# EAGLE design AmbaSat-05-ZMOD4410 (EAGLE 9.3.2)
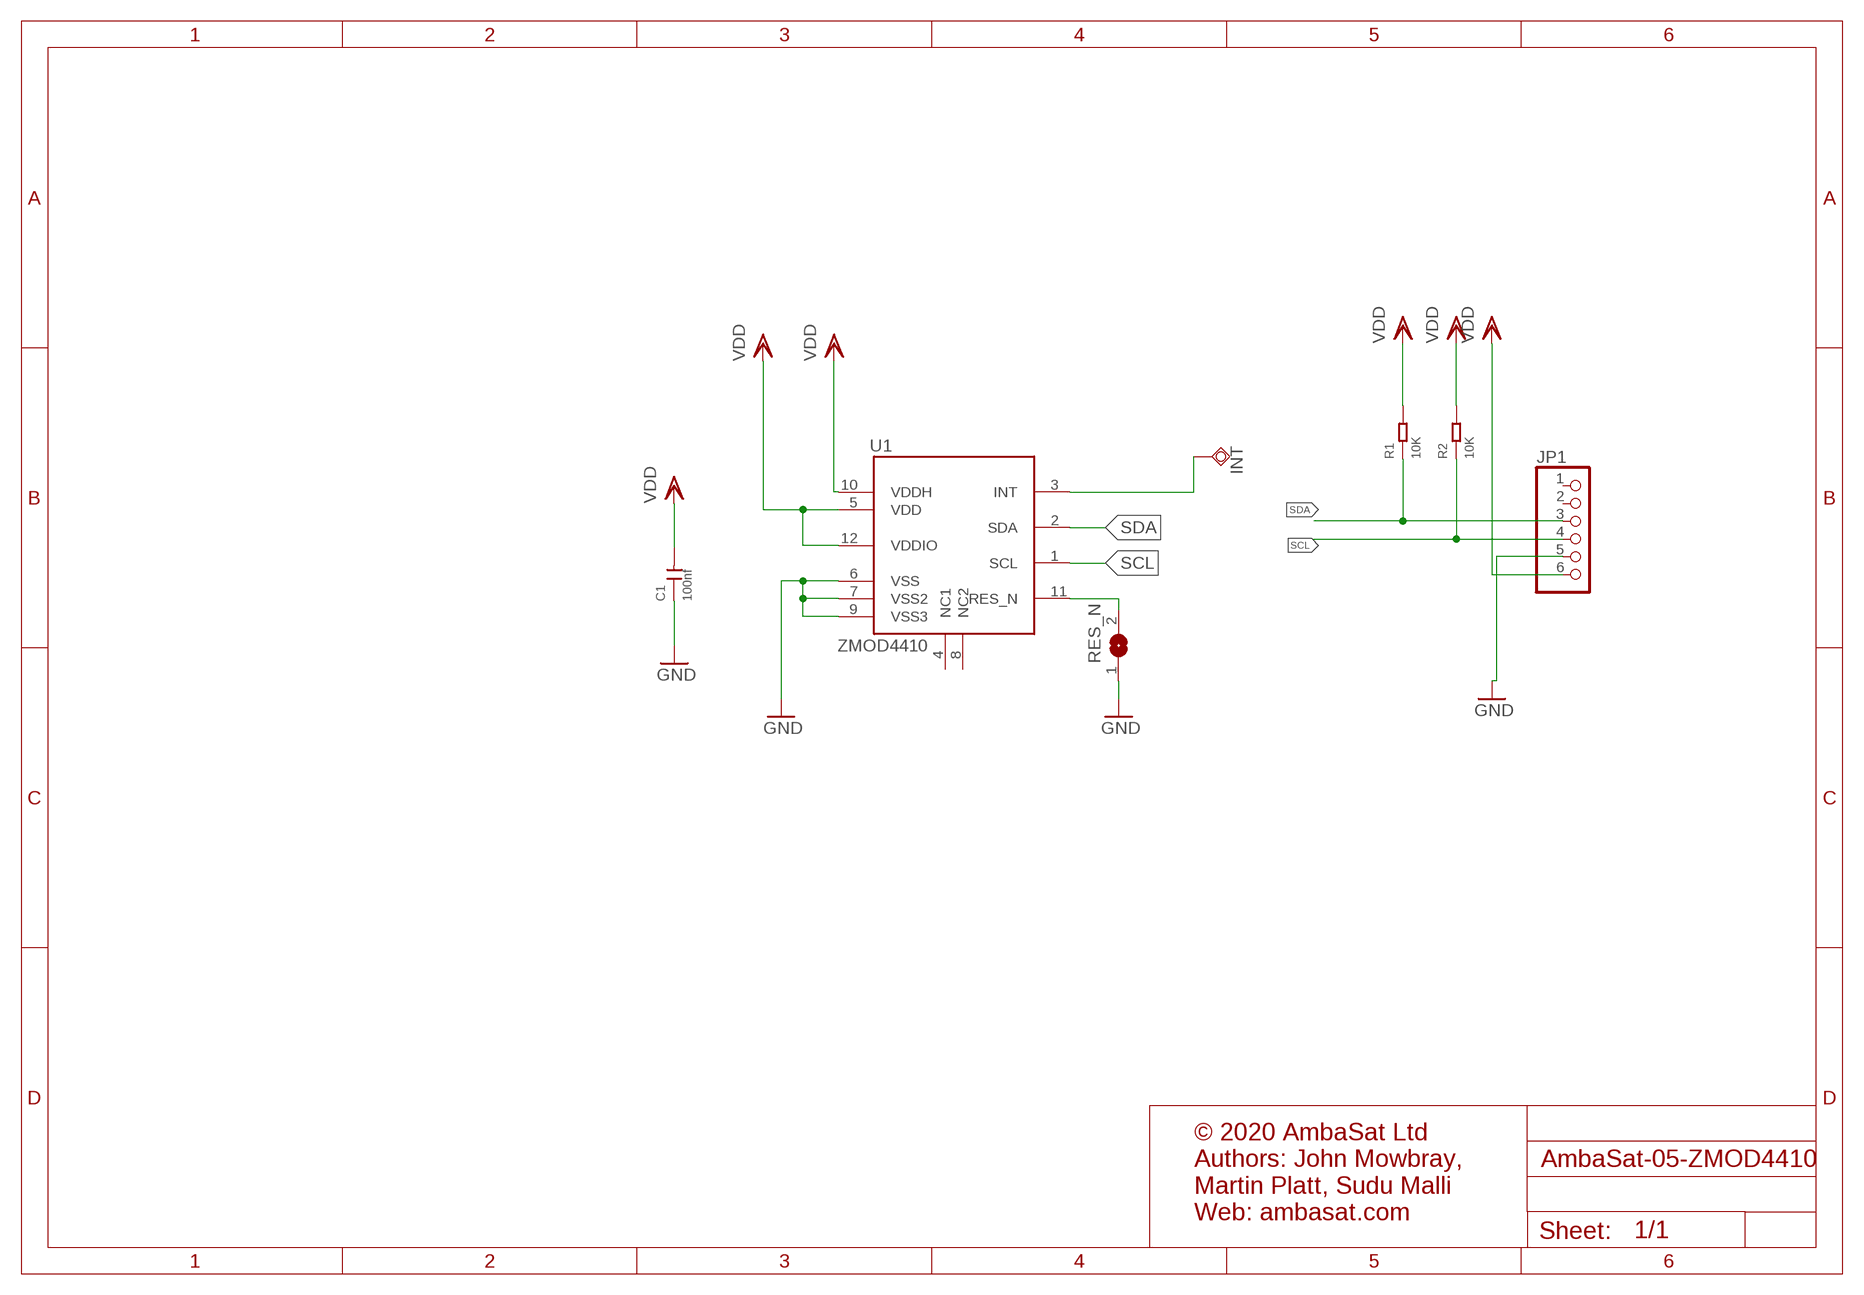
[diagram p0: schematic, sheet 1]

## Parts
C1  100nf  CERAMIC-100NF-50V-10%-X7R(0805)  [C0805]
INT  TESTPAD_TPSQTP12R  [TESTPAD_TP12R]
JP1  HEADER-1X6  [1X06_OVAL]
R1  10K  SMD-RES-10K-1%-1/8W(0805)  [R0805]
R2  10K  SMD-RES-10K-1%-1/8W(0805)  [R0805]
RES_N  SJ  [SJ]
U1  ZMOD4410  [LGG12D1_3X3X0.7_0.5X1]

## Nets
GND: C1.1 JP1.5 RES_N.1 U1.6(VSS) U1.7(VSS2) U1.9(VSS3)
N$1: INT.TP U1.3(INT)
N$2: RES_N.2 U1.11(RES_N)
SCL: JP1.4 R2.1 U1.1(SCL)
SDA: JP1.3 R1.1 U1.2(SDA)
VDD: C1.2 JP1.6 R1.2 R2.2 U1.5(VDD) U1.10(VDDH) U1.12(VDDIO)
Unconnected: JP1.1 JP1.2 U1.4(NC1) U1.8(NC2)

## Notes on the sheet
- © 2020 AmbaSat Ltd
  Authors: John Mowbray, 
  Martin Platt, Sudu Malli
  Web: ambasat.com

## Library data of the parts
C1 = Seeed-Capacitor:CERAMIC-100NF-50V-10%-X7R(0805): 302010165; MPN: CC0805KRX7R9BB104
INT = BeagleBone_Blue_R3:TESTPAD_TPSQ: Test pad
JP1 = microbuilder:HEADER-1X6: PIN HEADER
R1 R2 = Seeed-Resistor:SMD-RES-10K-1%-1/8W(0805): 301010361; MPN: RC0805FR-0710KL
RES_N = jumper:SJ: SMD solder JUMPER
U1 = ZMOD4410AI1V:ZMOD4410: Description The ZMOD4410 Gas Sensor Module is designed for detecting total volatile organic compounds (TVOC) and monitoring indoor air quality (IAQ) in different use cases. It is a 12-pin LGA assembly (3.0  3.0  0.7 mm) that consists of a gas sense element and a CMOS signal conditioning IC. The module’s sense element consists of heater element on a Si-based MEMS structure and a metal oxide (MOx) chemiresistor. The signal conditioner controls the sensor temperature and measures the MOx conductivity, which is a function of the gas concentration. The measurement results can be read via an I2C interface with the user’s microprocessor, which processes the data to determine the TVOC concentration, IAQ rating, and estimated carbon dioxide (eCO2) level. Alternatively, depending on the operation mode, the ZMOD4410 software can generate a control signal, which can trigger actions based on odor levels. With its low operating current consumption in Low-Power Operation Mode, the ZMOD4410 is an excellent choice for low-voltage and low-power battery applications. Built-in nonvolatile memory (NVM) stores the configuration and provides space for arbitrary user data.; DIGIKEY-PN: 1833-1030-ND; MANUFACTURER: IDT, Integrated Device Technology Inc; MPN: ZMOD4410AI1V

## Board
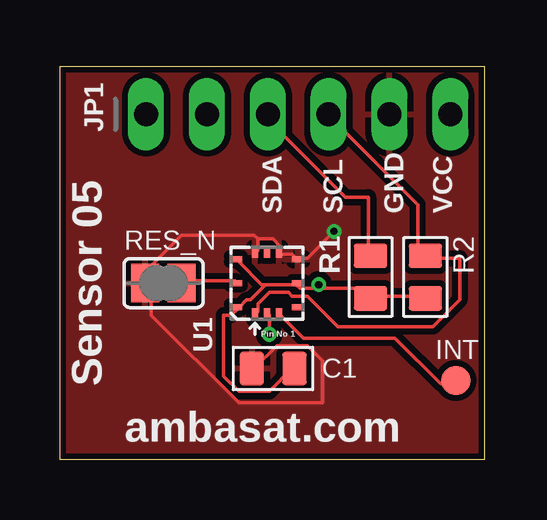
[diagram p1: board, top side]
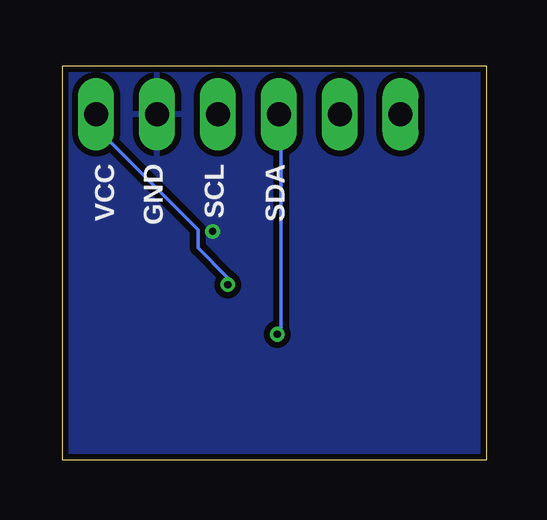
[diagram p2: board, bottom side, seen from below]

Size 17.7 x 16.4 mm. Coordinates in mm from the lower left corner, seen from the top.
Outline: 0,16.4 17.7,16.4 17.7,0 0,0 0,16.4
Copper layers (1*16): Top 0.035mm / dielectric 1.5mm / Bottom 0.035mm
Design rules "SeeedStudio_2layer_DRU_no_angle_20140221": minimum track width 6mil, minimum drill 12mil, track to track 6mil, track to pad 6mil, pad to pad 6mil, via to via 6mil, smd to smd 0mil, copper to edge 10mil, drill to drill 10mil, minimum pad ring 10mil, minimum via ring 6mil, stop-mask expansion 2mil, vias tented up to drill 100mil, thermal gap 10mil

### Footprints (pad centres in the part's own frame; a part is rotated, then mirrored left to right if it is on the bottom)
C0805 = smd 1.397 x 1.016: 1 0,0.889; 2 0,-0.889
TESTPAD_TP12R = smd 1.2 x 1.2: TP 0,0
1X06_OVAL = drill 1 long: 1 -6.35,0; 2 -3.81,0; 3 -1.27,0; 4 1.27,0; 5 3.81,0; 6 6.35,0
R0805 = smd 1.397 x 1.016: 1 0,0.889; 2 0,-0.889
SJ = smd 1.168 x 1.6: 1 -0.762,0; 2 0.762,0
LGG12D1_3X3X0.7_0.5X1 = smd 0.25 x 0.5: 1 -0.5,-1.3; 2 0,-1.3; 3 0.5,-1.3; 7 0.5,1.3; 8 0,1.3; 9 -0.5,1.3 | smd 0.5 x 0.25: 4 1.3,-1; 5 1.3,0; 6 1.3,1; 10 -1.3,1; 11 -1.3,0; 12 -1.3,-1

### Placement (x,y rotation side)
C1  8.89,3.81 90 top
INT  16.51,3.3 0 top
JP1  9.94,14.4 0 top
R1  12.95,7.62 0 top
R2  15.24,7.62 0 top
RES_N  4.32,7.37 0 top
U1  8.64,7.37 0 top

### Tracks (layer width: path | path; a pad name or v marks a point on that pad's centre or on a via)
GND  (via drill 0.3)
  Top 0.152: 8.26,9.21 8.26,8.73 U1.9 | 8.26,9.21 8.89,9.21 9.21,8.89 9.21,8.73 U1.7 9.21,8.57 9.68,8.57 9.84,8.41 U1.6 10,8.41 10.32,8.41 v11.43,9.53 | 8.26,9.21 8.1,9.37 5.08,9.37 3.65,7.94 3.65,7.46 RES_N.1 3.65,7.3 3.81,7.3 3.81,6.03 7.46,2.38 10.95,2.38 10.95,4.13 10.32,4.76 9.05,4.76 8.1,3.81 C1.1
  pour Top (isolate 0.254): 0,16.4 0,0 17.7,0 17.7,16.4
  pour Bottom (isolate 0.254): 0,16.4 0,0 17.7,0 17.7,16.4
N$1
  Top 0.152: U1.3 9.21,6.03 10.16,5.08 13.97,5.08 15.88,3.17 16.51,3.17 INT.TP
N$2
  Top 0.152: U1.11 7.3,7.46 5.08,7.46 RES_N.2
SCL
  Top 0.152: U1.1 8.26,6.19 8.26,6.51 8.73,6.99 9.53,6.99 9.68,6.83 10.32,6.83 11.59,5.56 15.56,5.56 16.67,6.67 16.67,8.41 15.24,8.41 R2.1 15.24,8.57 14.92,8.57 14.92,10.64 11.27,14.29 JP1.4
SDA  (via drill 0.3)
  Top 0.152: v8.73,5.24 8.73,6.03 U1.2 | R1.1 12.86,8.57 12.86,10.95 11.91,10.95 8.57,14.29 JP1.3
  Bottom 0.152: v8.73,5.24 8.57,5.4 8.57,14.29 JP1.3
VDD  (via drill 0.3)
  Top 0.152: R2.2 15.24,6.83 13.02,6.83 R1.2 12.54,7.14 10.79,7.14 | 7.46,6.35 7.78,6.67 7.94,6.67 8.57,7.3 | 9.84,7.3 8.57,7.3 | 8.57,7.3 8.41,7.3 7.46,8.26 U1.10 | 7.46,6.35 7.14,6.03 6.83,6.03 6.83,3.49 7.46,2.86 8.73,2.86 9.68,3.81 C1.2 | 7.46,6.35 U1.12 | 10.79,7.14 10,7.14 9.84,7.3 | 9.84,7.3 U1.5 | 10.79,7.14 v10.79,7.3
  Bottom 0.152: JP1.6 16.15,14.33 16.15,13.72 12.04,9.6 12.04,8.84 10.82,7.62 10.82,7.32 v10.79,7.3

### Text on the board
tPlace: Sensor 05 | SDA | SCL | GND | VCC | Pin No 1 | ambasat.com
bPlace: SDA | SCL | GND | VCC